# Altium schematic sheet Brushed_Motor_MCU.SchDoc
size A3; SheetNumber: 8; SheetTotal: 8
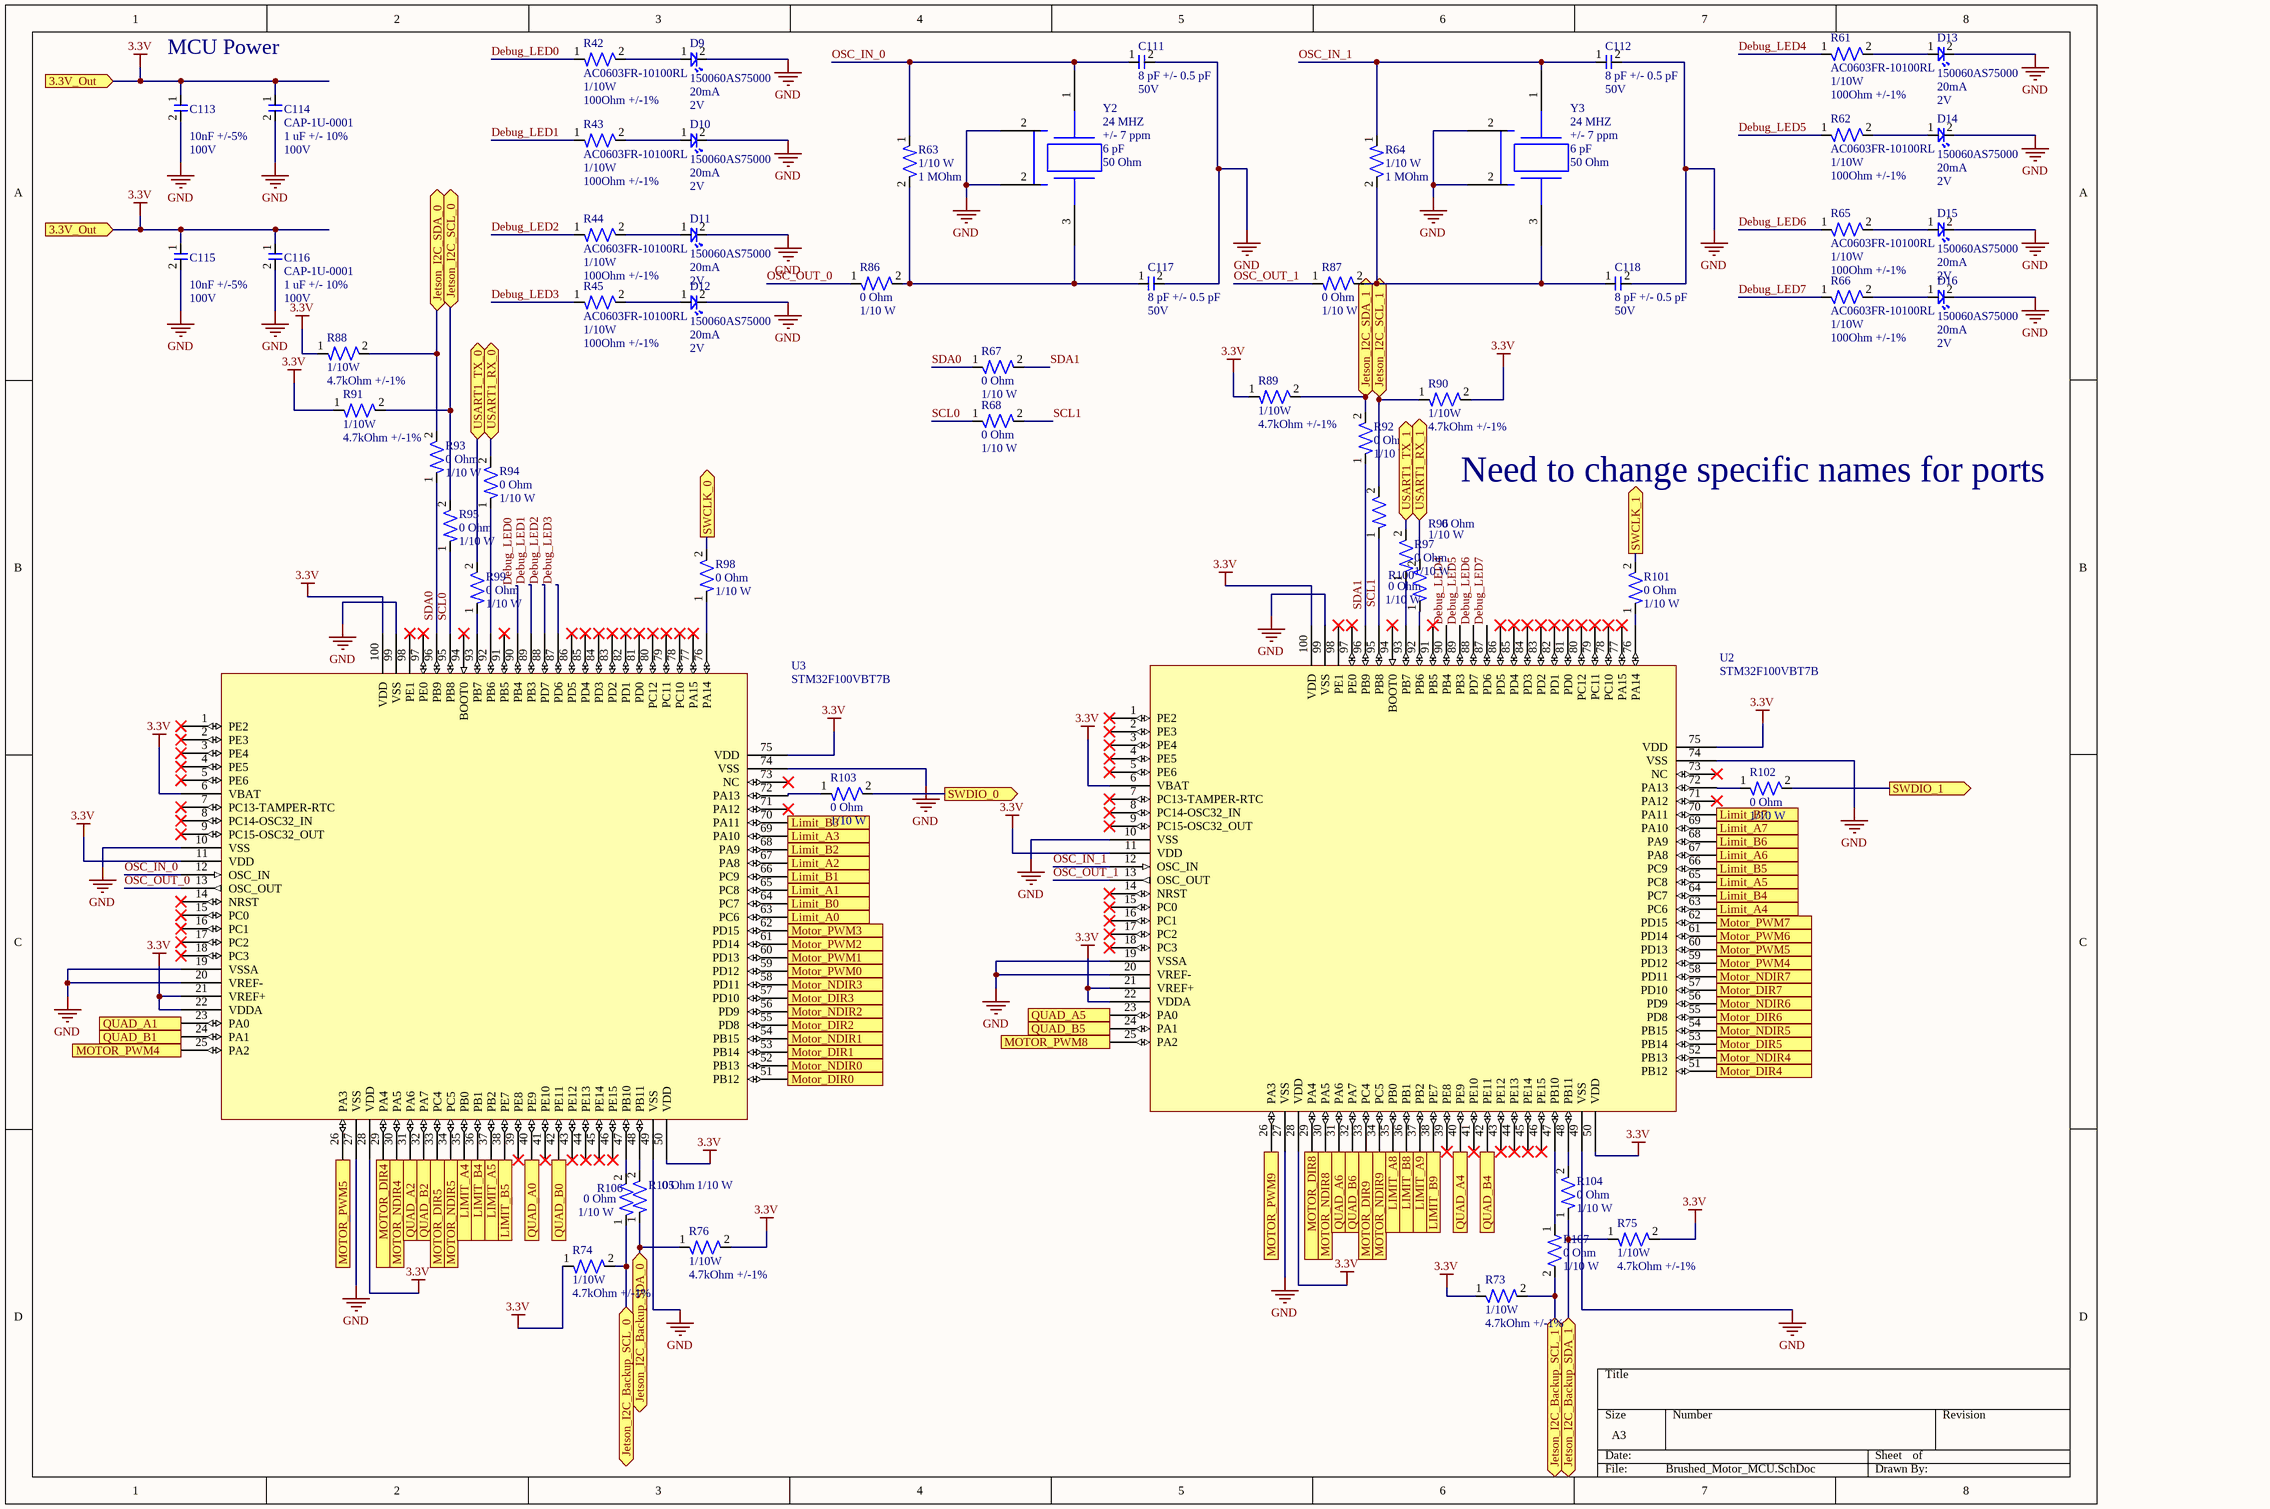
[diagram p0: Brushed_Motor_MCU.SchDoc]

## Parts
C111  Capacitance: 8 pF +/- 0.5 pF  Voltage: 50V  [CAP-0603]  (hidden comment: CC0603DRNPO9BN8R0)
C112  Capacitance: 8 pF +/- 0.5 pF  Voltage: 50V  [CAP-0603]  (hidden comment: CC0603DRNPO9BN8R0)
C113  Capacitance: 10nF +/-5%  Voltage Rating: 100V  [CAP-0603]  (hidden comment: C1608C0G2A103J080AC)
C114  CAP-1U-0001  Capacitance: 1 uF +/- 10%  Voltage: 100V  [CAP-1206 - duplicate]
C115  Capacitance: 10nF +/-5%  Voltage Rating: 100V  [CAP-0603]  (hidden comment: C1608C0G2A103J080AC)
C116  CAP-1U-0001  Capacitance: 1 uF +/- 10%  Voltage: 100V  [CAP-1206 - duplicate]
C117  Capacitance: 8 pF +/- 0.5 pF  Voltage: 50V  [CAP-0603]  (hidden comment: CC0603DRNPO9BN8R0)
C118  Capacitance: 8 pF +/- 0.5 pF  Voltage: 50V  [CAP-0603]  (hidden comment: CC0603DRNPO9BN8R0)
D9  150060AS75000  Current Rating: 20mA  Vf: 2V  [LED-0603]
D10  150060AS75000  Current Rating: 20mA  Vf: 2V  [LED-0603]
D11  150060AS75000  Current Rating: 20mA  Vf: 2V  [LED-0603]
D12  150060AS75000  Current Rating: 20mA  Vf: 2V  [LED-0603]
D13  150060AS75000  Current Rating: 20mA  Vf: 2V  [LED-0603]
D14  150060AS75000  Current Rating: 20mA  Vf: 2V  [LED-0603]
D15  150060AS75000  Current Rating: 20mA  Vf: 2V  [LED-0603]
D16  150060AS75000  Current Rating: 20mA  Vf: 2V  [LED-0603]
R42  AC0603FR-10100RL  Power Rating: 1/10W  Resistance: 100Ohm +/-1%  [RES-0603]
R43  AC0603FR-10100RL  Power Rating: 1/10W  Resistance: 100Ohm +/-1%  [RES-0603]
R44  AC0603FR-10100RL  Power Rating: 1/10W  Resistance: 100Ohm +/-1%  [RES-0603]
R45  AC0603FR-10100RL  Power Rating: 1/10W  Resistance: 100Ohm +/-1%  [RES-0603]
R61  AC0603FR-10100RL  Power Rating: 1/10W  Resistance: 100Ohm +/-1%  [RES-0603]
R62  AC0603FR-10100RL  Power Rating: 1/10W  Resistance: 100Ohm +/-1%  [RES-0603]
R63  Power: 1/10 W  Resistance: 1 MOhm  [RES-0603]  (hidden comment: RMCF0603FT1M00)
R64  Power: 1/10 W  Resistance: 1 MOhm  [RES-0603]  (hidden comment: RMCF0603FT1M00)
R65  AC0603FR-10100RL  Power Rating: 1/10W  Resistance: 100Ohm +/-1%  [RES-0603]
R66  AC0603FR-10100RL  Power Rating: 1/10W  Resistance: 100Ohm +/-1%  [RES-0603]
R67  Resistance: 0 Ohm  Power: 1/10 W  [RES-0603]  (hidden comment: RMCF0603ZT0R00)
R68  Resistance: 0 Ohm  Power: 1/10 W  [RES-0603]  (hidden comment: RMCF0603ZT0R00)
R73  Power Rating: 1/10W  Resistance: 4.7kOhm +/-1%  [RES-0603]  (hidden comment: AF0603FR-074K7L)
R74  Power Rating: 1/10W  Resistance: 4.7kOhm +/-1%  [RES-0603]  (hidden comment: AF0603FR-074K7L)
R75  Power Rating: 1/10W  Resistance: 4.7kOhm +/-1%  [RES-0603]  (hidden comment: AF0603FR-074K7L)
R76  Power Rating: 1/10W  Resistance: 4.7kOhm +/-1%  [RES-0603]  (hidden comment: AF0603FR-074K7L)
R86  Resistance: 0 Ohm  Power: 1/10 W  [RES-0603]  (hidden comment: RMCF0603ZT0R00)
R87  Resistance: 0 Ohm  Power: 1/10 W  [RES-0603]  (hidden comment: RMCF0603ZT0R00)
R88  Power Rating: 1/10W  Resistance: 4.7kOhm +/-1%  [RES-0603]  (hidden comment: AF0603FR-074K7L)
R89  Power Rating: 1/10W  Resistance: 4.7kOhm +/-1%  [RES-0603]  (hidden comment: AF0603FR-074K7L)
R90  Power Rating: 1/10W  Resistance: 4.7kOhm +/-1%  [RES-0603]  (hidden comment: AF0603FR-074K7L)
R91  Power Rating: 1/10W  Resistance: 4.7kOhm +/-1%  [RES-0603]  (hidden comment: AF0603FR-074K7L)
R92  Resistance: 0 Ohm  Power: 1/10 W  [RES-0603]  (hidden comment: RMCF0603ZT0R00)
R93  Resistance: 0 Ohm  Power: 1/10 W  [RES-0603]  (hidden comment: RMCF0603ZT0R00)
R94  Resistance: 0 Ohm  Power: 1/10 W  [RES-0603]  (hidden comment: RMCF0603ZT0R00)
R95  Resistance: 0 Ohm  Power: 1/10 W  [RES-0603]  (hidden comment: RMCF0603ZT0R00)
R96  Resistance: 0 Ohm  Power: 1/10 W  [RES-0603]  (hidden comment: RMCF0603ZT0R00)
R97  Resistance: 0 Ohm  Power: 1/10 W  [RES-0603]  (hidden comment: RMCF0603ZT0R00)
R98  Resistance: 0 Ohm  Power: 1/10 W  [RES-0603]  (hidden comment: RMCF0603ZT0R00)
R99  Resistance: 0 Ohm  Power: 1/10 W  [RES-0603]  (hidden comment: RMCF0603ZT0R00)
R100  Resistance: 0 Ohm  Power: 1/10 W  [RES-0603]  (hidden comment: RMCF0603ZT0R00)
R101  Resistance: 0 Ohm  Power: 1/10 W  [RES-0603]  (hidden comment: RMCF0603ZT0R00)
R102  Resistance: 0 Ohm  Power: 1/10 W  [RES-0603]  (hidden comment: RMCF0603ZT0R00)
R103  Resistance: 0 Ohm  Power: 1/10 W  [RES-0603]  (hidden comment: RMCF0603ZT0R00)
R104  Resistance: 0 Ohm  Power: 1/10 W  [RES-0603]  (hidden comment: RMCF0603ZT0R00)
R105  Resistance: 0 Ohm  Power: 1/10 W  [RES-0603]  (hidden comment: RMCF0603ZT0R00)
R106  Resistance: 0 Ohm  Power: 1/10 W  [RES-0603]  (hidden comment: RMCF0603ZT0R00)
R107  Resistance: 0 Ohm  Power: 1/10 W  [RES-0603]  (hidden comment: RMCF0603ZT0R00)
U2  STM32F100VBT7B  [IC-STM32F100-0001]
U3  STM32F100VBT7B  [IC-STM32F100-0001]
Y2  Frequency: 24 MHZ  Frequency Tolerance: +/- 7 ppm  Load Capacitance: 6 pF  Equavalence Series Resistance: 50 Ohm  [CRYSTAL-4-SMD-0001]  (hidden comment: ECS-240-6-37B-7KM-TR)
Y3  Frequency: 24 MHZ  Frequency Tolerance: +/- 7 ppm  Load Capacitance: 6 pF  Equavalence Series Resistance: 50 Ohm  [CRYSTAL-4-SMD-0001]  (hidden comment: ECS-240-6-37B-7KM-TR)

## Ports
3.3V_Out (in), Jetson_I2C_Backup_SCL_0 (bidir), Jetson_I2C_Backup_SCL_1 (bidir), Jetson_I2C_Backup_SDA_0 (bidir), Jetson_I2C_Backup_SDA_1 (bidir), Jetson_I2C_SCL_0 (bidir), Jetson_I2C_SCL_1 (bidir), Jetson_I2C_SDA_0 (bidir), Jetson_I2C_SDA_1 (bidir), Limit_A0 (out), Limit_A1 (out), Limit_A2 (out), Limit_A3 (out), LIMIT_A4 (out), Limit_A4 (out), LIMIT_A5 (out), Limit_A5 (out), Limit_A6 (out), Limit_A7 (out), LIMIT_A8 (out), LIMIT_A9 (out), Limit_B0 (out), Limit_B1 (out), Limit_B2 (out), Limit_B3 (out), LIMIT_B4 (out), Limit_B4 (out), LIMIT_B5 (out), Limit_B5 (out), Limit_B6 (out), Limit_B7 (out), LIMIT_B8 (out), LIMIT_B9 (out), Motor_DIR0 (out), Motor_DIR1 (out), Motor_DIR2 (out), Motor_DIR3 (out), MOTOR_DIR4 (out), Motor_DIR4 (out), MOTOR_DIR5 (out), Motor_DIR5 (out), Motor_DIR6 (out), Motor_DIR7 (out), MOTOR_DIR8 (out), MOTOR_DIR9 (out), Motor_NDIR0 (out), Motor_NDIR1 (out), Motor_NDIR2 (out), Motor_NDIR3 (out), MOTOR_NDIR4 (out), Motor_NDIR4 (out), MOTOR_NDIR5 (out), Motor_NDIR5 (out), Motor_NDIR6 (out), Motor_NDIR7 (out), MOTOR_NDIR8 (out), MOTOR_NDIR9 (out), Motor_PWM0 (out), Motor_PWM1 (out), Motor_PWM2 (out), Motor_PWM3 (out), MOTOR_PWM4 (out), Motor_PWM4 (out), MOTOR_PWM5 (out), Motor_PWM5 (out), Motor_PWM6 (out), Motor_PWM7 (out), MOTOR_PWM8 (out), MOTOR_PWM9 (out), QUAD_A0 (out), QUAD_A1 (out), QUAD_A2 (out), QUAD_A4 (out), QUAD_A5 (out), QUAD_A6 (out), QUAD_B0 (out), QUAD_B1 (out), QUAD_B2 (out), QUAD_B4 (out), QUAD_B5 (out), QUAD_B6 (out), SWCLK_0 (out), SWCLK_1 (out), SWDIO_0 (out), SWDIO_1 (out), USART1_RX_0 (bidir), USART1_RX_1 (bidir), USART1_TX_0 (bidir), USART1_TX_1 (bidir)

## Nets
3.3V: C113.1 C114.1 C115.1 C116.1 R73.1 R74.1 R75.2 R76.2 R88.1 R89.1 R90.2 R91.1 U2.6(VBAT) U2.11(VDD) U2.21(VREF+) U2.22(VDDA) U2.28(VDD) U2.50(VDD) U2.75(VDD) U2.100(VDD) U3.6(VBAT) U3.11(VDD) U3.21(VREF+) U3.22(VDDA) U3.28(VDD) U3.50(VDD) U3.75(VDD) U3.100(VDD) ; port 3.3V_Out
GND: C111.2 C112.2 C113.2 C114.2 C115.2 C116.2 C117.2 C118.2 D9.2 D10.2 D11.2 D12.2 D13.2 D14.2 D15.2 D16.2 U2.10(VSS) U2.19(VSSA) U2.20(VREF-) U2.27(VSS) U2.49(VSS) U2.74(VSS) U2.99(VSS) U3.10(VSS) U3.19(VSSA) U3.20(VREF-) U3.27(VSS) U3.49(VSS) U3.74(VSS) U3.99(VSS) Y2.2 Y3.2
Debug_LED0: R42.1 U3.90(PB4)
Debug_LED1: R43.1 U3.89(PB3)
Debug_LED2: R44.1 U3.88(PD7)
Debug_LED3: R45.1 U3.87(PD6)
Debug_LED4: R61.1 U2.90(PB4)
Debug_LED5: R62.1 U2.89(PB3)
Debug_LED6: R65.1 U2.88(PD7)
Debug_LED7: R66.1 U2.87(PD6)
Jetson_I2C_Backup_SCL_0: R74.2 R106.1 ; port Jetson_I2C_Backup_SCL_0
Jetson_I2C_Backup_SCL_1: R73.2 R107.2 ; port Jetson_I2C_Backup_SCL_1
Jetson_I2C_Backup_SDA_0: R76.1 R105.1 ; port Jetson_I2C_Backup_SDA_0
Jetson_I2C_Backup_SDA_1: R75.1 R104.1 ; port Jetson_I2C_Backup_SDA_1
Jetson_I2C_SCL_0: R91.2 R95.2 ; port Jetson_I2C_SCL_0
Jetson_I2C_SCL_1: R90.1 R96.2 ; port Jetson_I2C_SCL_1
Jetson_I2C_SDA_0: R88.2 R93.2 ; port Jetson_I2C_SDA_0
Jetson_I2C_SDA_1: R89.2 R92.2 ; port Jetson_I2C_SDA_1
Limit_A0: U3.63(PC6) ; port Limit_A0
Limit_A1: U3.65(PC8) ; port Limit_A1
Limit_A2: U3.67(PA8) ; port Limit_A2
Limit_A3: U3.69(PA10) ; port Limit_A3
LIMIT_A4: U2.63(PC6) U3.35(PB0) ; port LIMIT_A4, port Limit_A4
LIMIT_A5: U2.65(PC8) U3.37(PB2) ; port LIMIT_A5, port Limit_A5
Limit_A6: U2.67(PA8) ; port Limit_A6
Limit_A7: U2.69(PA10) ; port Limit_A7
LIMIT_A8: U2.35(PB0) ; port LIMIT_A8
LIMIT_A9: U2.37(PB2) ; port LIMIT_A9
Limit_B0: U3.64(PC7) ; port Limit_B0
Limit_B1: U3.66(PC9) ; port Limit_B1
Limit_B2: U3.68(PA9) ; port Limit_B2
Limit_B3: U3.70(PA11) ; port Limit_B3
LIMIT_B4: U2.64(PC7) U3.36(PB1) ; port LIMIT_B4, port Limit_B4
LIMIT_B5: U2.66(PC9) U3.38(PE7) ; port LIMIT_B5, port Limit_B5
Limit_B6: U2.68(PA9) ; port Limit_B6
Limit_B7: U2.70(PA11) ; port Limit_B7
LIMIT_B8: U2.36(PB1) ; port LIMIT_B8
LIMIT_B9: U2.38(PE7) ; port LIMIT_B9
Motor_DIR0: U3.51(PB12) ; port Motor_DIR0
Motor_DIR1: U3.53(PB14) ; port Motor_DIR1
Motor_DIR2: U3.55(PD8) ; port Motor_DIR2
Motor_DIR3: U3.57(PD10) ; port Motor_DIR3
MOTOR_DIR4: U2.51(PB12) U3.29(PA4) ; port MOTOR_DIR4, port Motor_DIR4
MOTOR_DIR5: U2.53(PB14) U3.33(PC4) ; port MOTOR_DIR5, port Motor_DIR5
Motor_DIR6: U2.55(PD8) ; port Motor_DIR6
Motor_DIR7: U2.57(PD10) ; port Motor_DIR7
MOTOR_DIR8: U2.29(PA4) ; port MOTOR_DIR8
MOTOR_DIR9: U2.33(PC4) ; port MOTOR_DIR9
Motor_NDIR0: U3.52(PB13) ; port Motor_NDIR0
Motor_NDIR1: U3.54(PB15) ; port Motor_NDIR1
Motor_NDIR2: U3.56(PD9) ; port Motor_NDIR2
Motor_NDIR3: U3.58(PD11) ; port Motor_NDIR3
MOTOR_NDIR4: U2.52(PB13) U3.30(PA5) ; port MOTOR_NDIR4, port Motor_NDIR4
MOTOR_NDIR5: U2.54(PB15) U3.34(PC5) ; port MOTOR_NDIR5, port Motor_NDIR5
Motor_NDIR6: U2.56(PD9) ; port Motor_NDIR6
Motor_NDIR7: U2.58(PD11) ; port Motor_NDIR7
MOTOR_NDIR8: U2.30(PA5) ; port MOTOR_NDIR8
MOTOR_NDIR9: U2.34(PC5) ; port MOTOR_NDIR9
Motor_PWM0: U3.59(PD12) ; port Motor_PWM0
Motor_PWM1: U3.60(PD13) ; port Motor_PWM1
Motor_PWM2: U3.61(PD14) ; port Motor_PWM2
Motor_PWM3: U3.62(PD15) ; port Motor_PWM3
MOTOR_PWM4: U2.59(PD12) U3.25(PA2) ; port MOTOR_PWM4, port Motor_PWM4
MOTOR_PWM5: U2.60(PD13) U3.26(PA3) ; port MOTOR_PWM5, port Motor_PWM5
Motor_PWM6: U2.61(PD14) ; port Motor_PWM6
Motor_PWM7: U2.62(PD15) ; port Motor_PWM7
MOTOR_PWM8: U2.25(PA2) ; port MOTOR_PWM8
MOTOR_PWM9: U2.26(PA3) ; port MOTOR_PWM9
OSC_IN_0: C111.1 R63.1 U3.12(OSC_IN) Y2.1
OSC_IN_1: C112.1 R64.1 U2.12(OSC_IN) Y3.1
OSC_OUT_0: R86.1 U3.13(OSC_OUT)
OSC_OUT_1: R87.1 U2.13(OSC_OUT)
QUAD_A0: U3.40(PE9) ; port QUAD_A0
QUAD_A1: U3.23(PA0) ; port QUAD_A1
QUAD_A2: U3.31(PA6) ; port QUAD_A2
QUAD_A4: U2.40(PE9) ; port QUAD_A4
QUAD_A5: U2.23(PA0) ; port QUAD_A5
QUAD_A6: U2.31(PA6) ; port QUAD_A6
QUAD_B0: U3.42(PE11) ; port QUAD_B0
QUAD_B1: U3.24(PA1) ; port QUAD_B1
QUAD_B2: U3.32(PA7) ; port QUAD_B2
QUAD_B4: U2.42(PE11) ; port QUAD_B4
QUAD_B5: U2.24(PA1) ; port QUAD_B5
QUAD_B6: U2.32(PA7) ; port QUAD_B6
SCL0: R68.1 R95.1 U3.95(PB8)
SCL1: R68.2 R96.1 U2.95(PB8)
SDA0: R67.1 R93.1 U3.96(PB9)
SDA1: R67.2 R92.1 U2.96(PB9)
SWCLK_0: R98.2 ; port SWCLK_0
SWCLK_1: R101.2 ; port SWCLK_1
SWDIO_0: R103.2 ; port SWDIO_0
SWDIO_1: R102.2 ; port SWDIO_1
USART1_RX_0: R94.2 ; port USART1_RX_0
USART1_RX_1: R100.2 ; port USART1_RX_1
USART1_TX_0: R99.2 ; port USART1_TX_0
USART1_TX_1: R97.2 ; port USART1_TX_1
NetC117_1: C117.1 R63.2 R86.2 Y2.3
NetC118_1: C118.1 R64.2 R87.2 Y3.3
NetD9_1: D9.1 R42.2
NetD10_1: D10.1 R43.2
NetD11_1: D11.1 R44.2
NetD12_1: D12.1 R45.2
NetD13_1: D13.1 R61.2
NetD14_1: D14.1 R62.2
NetD15_1: D15.1 R65.2
NetD16_1: D16.1 R66.2
NetR94_1: R94.1 U3.92(PB6)
NetR97_1: R97.1 U2.93(PB7)
NetR98_1: R98.1 U3.76(PA14)
NetR99_1: R99.1 U3.93(PB7)
NetR100_1: R100.1 U2.92(PB6)
NetR101_1: R101.1 U2.76(PA14)
NetR102_1: R102.1 U2.72(PA13)
NetR103_1: R103.1 U3.72(PA13)
NetR104_2: R104.2 U2.48(PB11)
NetR105_2: R105.2 U3.48(PB11)
NetR106_2: R106.2 U3.47(PB10)
NetR107_1: R107.1 U2.47(PB10)

Not connected (* = marked no-connect by the designer): U2 1(PE2)* 2(PE3)* 3(PE4)* 4(PE5)* 5(PE6)* 7(PC13-TAMPER-RTC)* 8(PC14-OSC32_IN)* 9(PC15-OSC32_OUT)* 14(NRST)* 15(PC0)* 16(PC1)* 17(PC2)* 18(PC3)* 39(PE8)* 41(PE10)* 43(PE12)* 44(PE13)* 45(PE14)* 46(PE15)* 71(PA12)* 73(NC)* 77(PA15)* 78(PC10)* 79(PC11)* 80(PC12)* 81(PD0)* 82(PD1)* 83(PD2)* 84(PD3)* 85(PD4)* 86(PD5)* 91(PB5)* 94(BOOT0)* 97(PE0)* 98(PE1)*; U3 1(PE2)* 2(PE3)* 3(PE4)* 4(PE5)* 5(PE6)* 7(PC13-TAMPER-RTC)* 8(PC14-OSC32_IN)* 9(PC15-OSC32_OUT)* 14(NRST)* 15(PC0)* 16(PC1)* 17(PC2)* 18(PC3)* 39(PE8)* 41(PE10)* 43(PE12)* 44(PE13)* 45(PE14)* 46(PE15)* 71(PA12)* 73(NC)* 77(PA15)* 78(PC10)* 79(PC11)* 80(PC12)* 81(PD0)* 82(PD1)* 83(PD2)* 84(PD3)* 85(PD4)* 86(PD5)* 91(PB5)* 94(BOOT0)* 97(PE0)* 98(PE1)*

## Notes on the sheet
- MCU Power
- Need to change specific names for ports

## Library data of the parts
C111 C112 C117 C118 = CAP-8P-0001: 8 pF ±0.5pF 50V Ceramic Capacitor C0G, NP0 0603 (1608 Metric); Package Size: 0603
C113 C115 = CAP-10N-0002: CAP CER 10000PF 100V C0G 0603; Manufacturer: TDK Corporation; Temperature Coefficient: C0G/NP0; Assembled?: no; Manufacturer Part Number: C1608C0G2A103J080AC; Package Size: 0603
C114 C116 = CAP-1U-0001: 1 µF ±10% 100V Ceramic Capacitor X7R 1206 (3216 Metric)
D9-D16 = LED_Amber_0001: CAP CER 0.1UF 100V X7R 0603; Manufacturer: Wurth Electronik; Assembled?: no; Color: Amber; Manufacturer Part Number: 150060AS75000; Package Size: 0603
R42-R45 R61 R62 R65 R66 = RES-100-0002: RESISTOR SMD; Manufacturer: YAGEO; Assembled?: no; Manufacturer Part Number: AC0603FR-10100RL; Package Size: 0603
R63 R64 = RES-1M-0001: 1 MOhms ±1% 0.1W, 1/10W Chip Resistor 0603 (1608 Metric) Automotive AEC-Q200 Thick Film; Package Size: 0603
R67 R68 R86 R87 R92-R107 = RES-0-0001: 0 Ohms Jumper 0.1W, 1/10W Chip Resistor 0603 (1608 Metric) Automotive AEC-Q200 Thick Film; Package Size: 0603
R73-R76 R88-R91 = RES-4.7K-0002: RES SMD 4.7K OHM 1% 1/10W 0603; Manufacturer: YAGEO; Assembled?: no; Manufacturer Part Number: AF0603FR-074K7L; Package Size: 0603
U2 U3 = IC-STM32F100-0001: ARM® Cortex®-M3 STM32F1 Microcontroller IC 32-Bit Single-Core 24MHz 128KB (128K x 8) FLASH 100-LQFP (14x14); VCC: 2 ~ 3.6V; Manufacturer Part Number: STM32F100VBT7B; Package Size: 100-LQFP
Y2 Y3 = CRYSTAL-24MHz-0001: 24 MHz ±7ppm Crystal 6pF 50 Ohms 4-SMD, No Lead; Manufacturer: ECS Inc.; Manufacturer Part Number: ECS-240-6-37B-7KM-TR; Package Size: 4-SMD